# EAGLE design 8x8BulbMatrix (EAGLE 9.6.2)
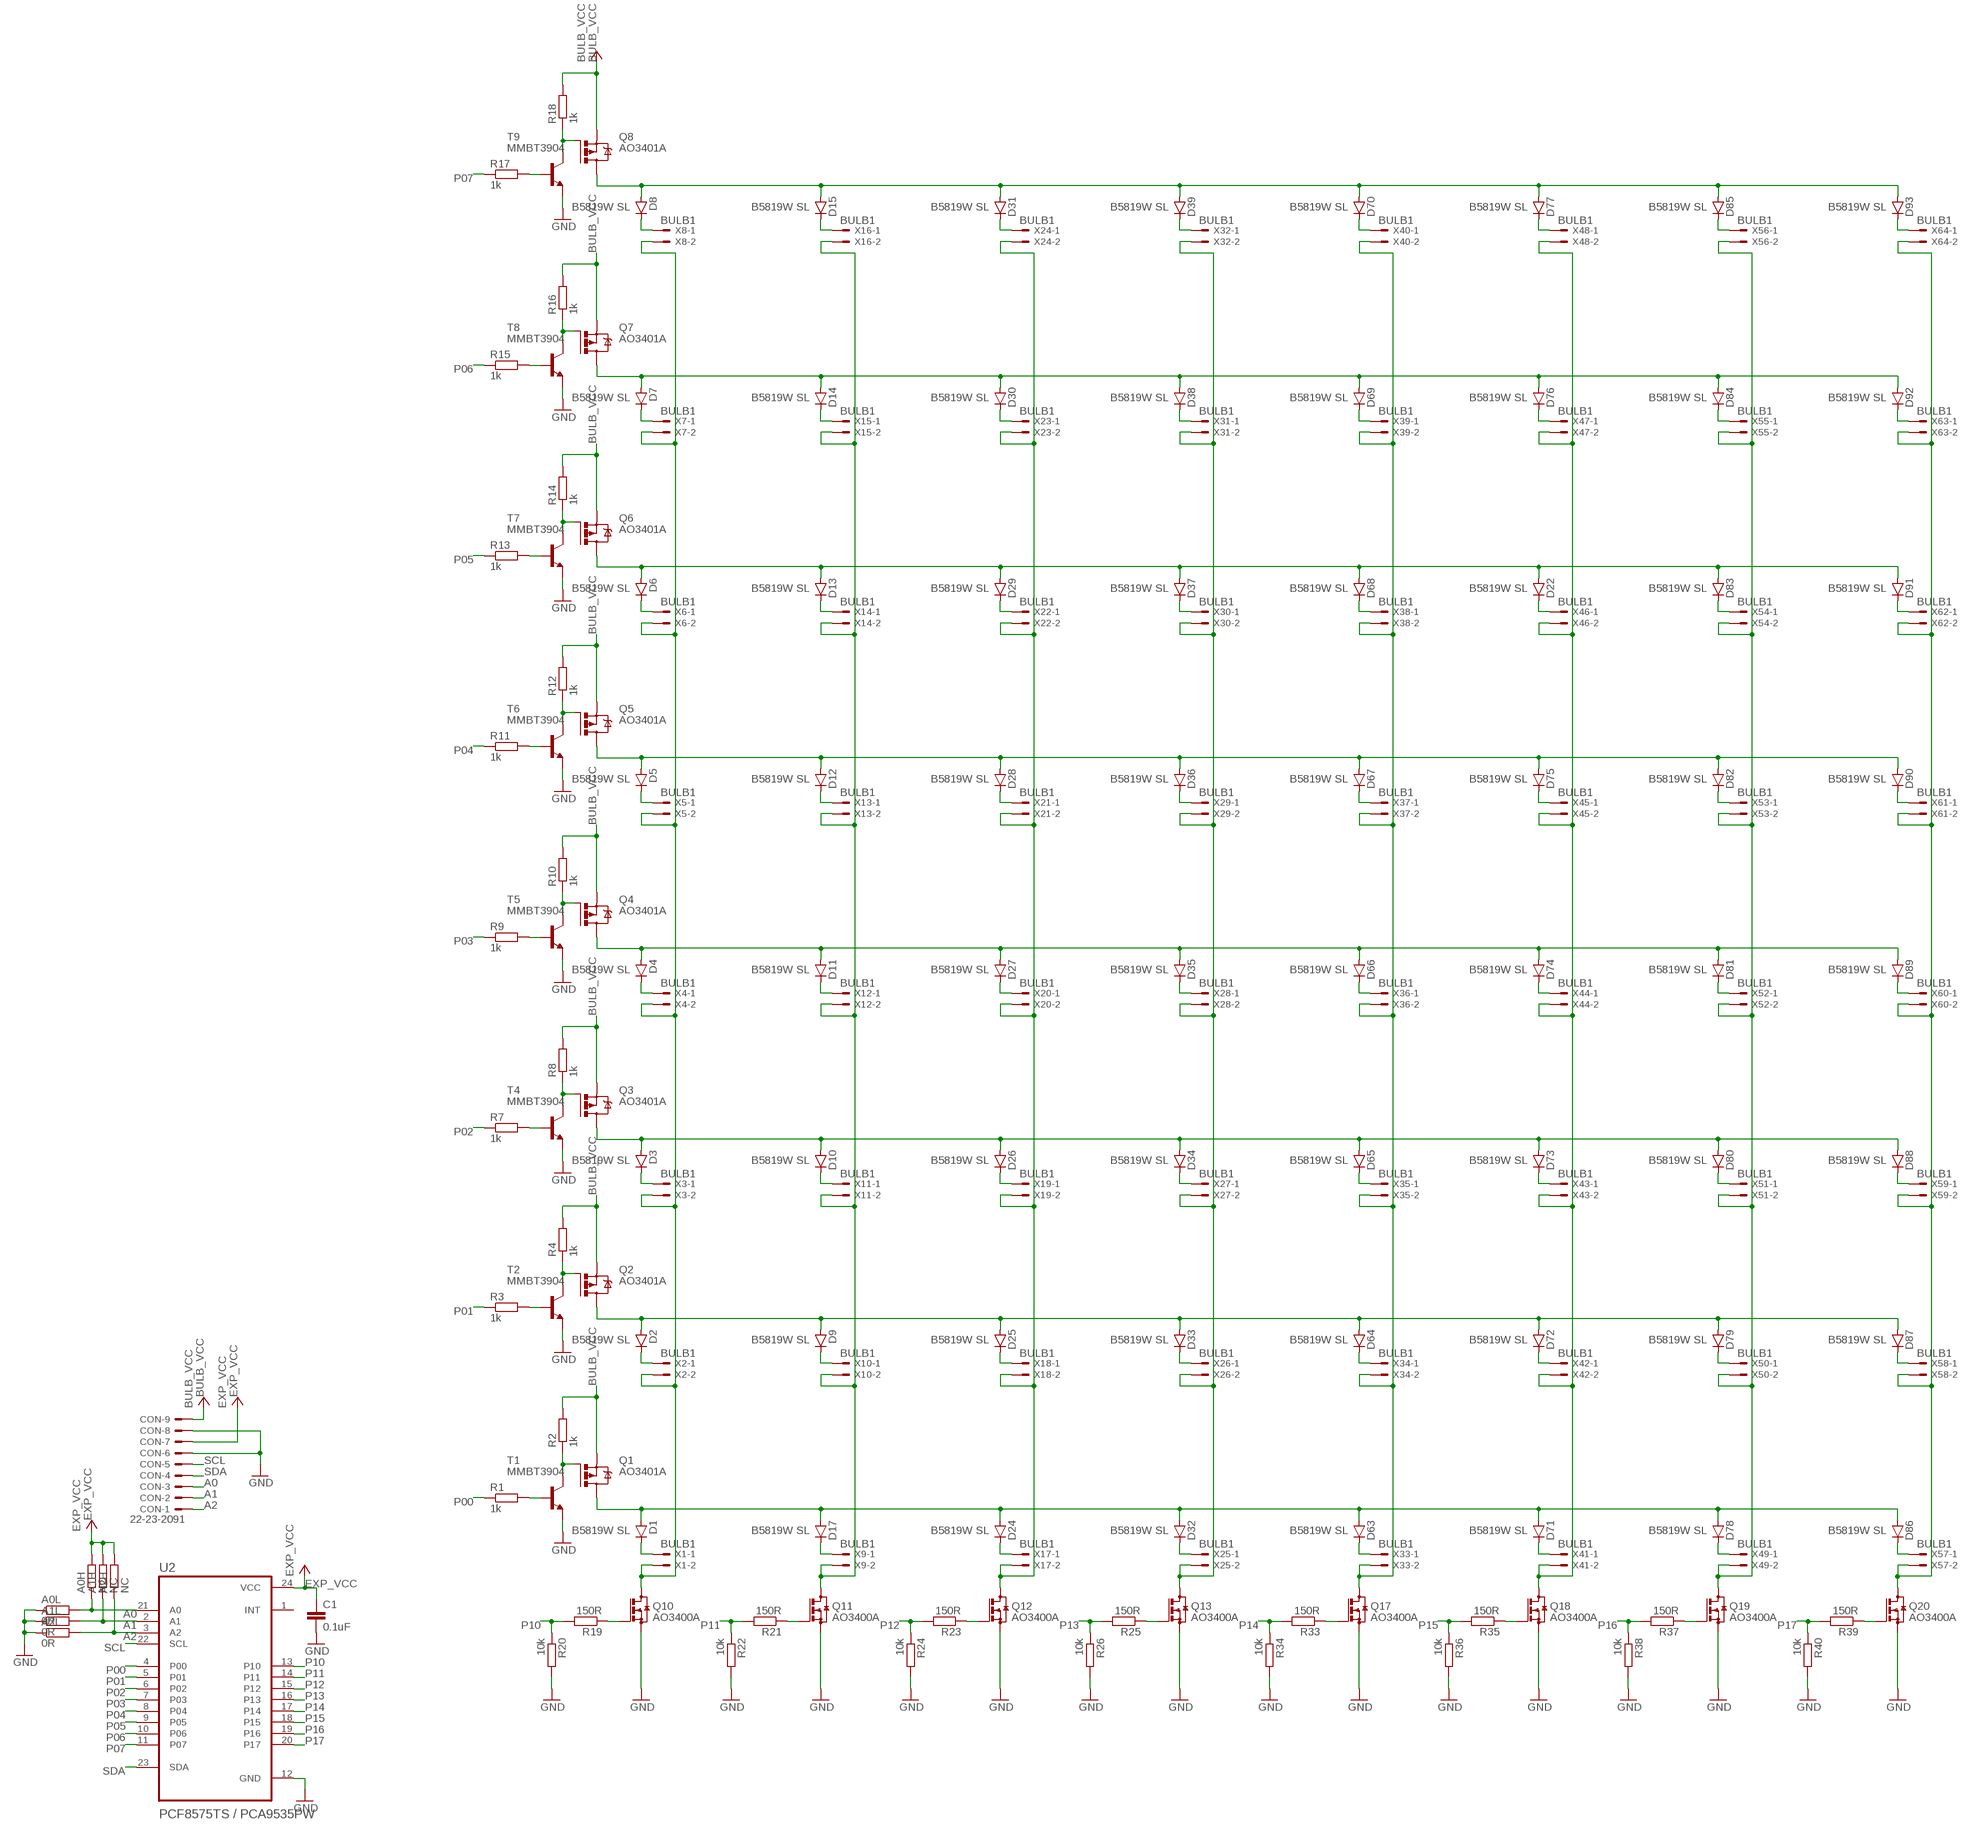
[diagram p0: schematic, sheet 1]

## Parts
A0H  NC  R-EU_R0603  [R0603]
A0L  0R  R-EU_R0603  [R0603]
A1H  NC  R-EU_R0603  [R0603]
A1L  0R  R-EU_R0603  [R0603]
A2H  NC  R-EU_R0603  [R0603]
A2L  0R  R-EU_R0603  [R0603]
C1  0.1uF  C-EUC0805  [C0805]
CON  22-23-2091  [22-23-2091]
D1  B5819W SL  D-SOD123  [SOD123]
D2  B5819W SL  D-SOD123  [SOD123]
D3  B5819W SL  D-SOD123  [SOD123]
D4  B5819W SL  D-SOD123  [SOD123]
D5  B5819W SL  D-SOD123  [SOD123]
D6  B5819W SL  D-SOD123  [SOD123]
D7  B5819W SL  D-SOD123  [SOD123]
D8  B5819W SL  D-SOD123  [SOD123]
D9  B5819W SL  D-SOD123  [SOD123]
D10  B5819W SL  D-SOD123  [SOD123]
D11  B5819W SL  D-SOD123  [SOD123]
D12  B5819W SL  D-SOD123  [SOD123]
D13  B5819W SL  D-SOD123  [SOD123]
D14  B5819W SL  D-SOD123  [SOD123]
D15  B5819W SL  D-SOD123  [SOD123]
D17  B5819W SL  D-SOD123  [SOD123]
D22  B5819W SL  D-SOD123  [SOD123]
D24  B5819W SL  D-SOD123  [SOD123]
D25  B5819W SL  D-SOD123  [SOD123]
D26  B5819W SL  D-SOD123  [SOD123]
D27  B5819W SL  D-SOD123  [SOD123]
D28  B5819W SL  D-SOD123  [SOD123]
D29  B5819W SL  D-SOD123  [SOD123]
D30  B5819W SL  D-SOD123  [SOD123]
D31  B5819W SL  D-SOD123  [SOD123]
D32  B5819W SL  D-SOD123  [SOD123]
D33  B5819W SL  D-SOD123  [SOD123]
D34  B5819W SL  D-SOD123  [SOD123]
D35  B5819W SL  D-SOD123  [SOD123]
D36  B5819W SL  D-SOD123  [SOD123]
D37  B5819W SL  D-SOD123  [SOD123]
D38  B5819W SL  D-SOD123  [SOD123]
D39  B5819W SL  D-SOD123  [SOD123]
D63  B5819W SL  D-SOD123  [SOD123]
D64  B5819W SL  D-SOD123  [SOD123]
D65  B5819W SL  D-SOD123  [SOD123]
D66  B5819W SL  D-SOD123  [SOD123]
D67  B5819W SL  D-SOD123  [SOD123]
D68  B5819W SL  D-SOD123  [SOD123]
D69  B5819W SL  D-SOD123  [SOD123]
D70  B5819W SL  D-SOD123  [SOD123]
D71  B5819W SL  D-SOD123  [SOD123]
D72  B5819W SL  D-SOD123  [SOD123]
D73  B5819W SL  D-SOD123  [SOD123]
D74  B5819W SL  D-SOD123  [SOD123]
D75  B5819W SL  D-SOD123  [SOD123]
D76  B5819W SL  D-SOD123  [SOD123]
D77  B5819W SL  D-SOD123  [SOD123]
D78  B5819W SL  D-SOD123  [SOD123]
D79  B5819W SL  D-SOD123  [SOD123]
D80  B5819W SL  D-SOD123  [SOD123]
D81  B5819W SL  D-SOD123  [SOD123]
D82  B5819W SL  D-SOD123  [SOD123]
D83  B5819W SL  D-SOD123  [SOD123]
D84  B5819W SL  D-SOD123  [SOD123]
D85  B5819W SL  D-SOD123  [SOD123]
D86  B5819W SL  D-SOD123  [SOD123]
D87  B5819W SL  D-SOD123  [SOD123]
D88  B5819W SL  D-SOD123  [SOD123]
D89  B5819W SL  D-SOD123  [SOD123]
D90  B5819W SL  D-SOD123  [SOD123]
D91  B5819W SL  D-SOD123  [SOD123]
D92  B5819W SL  D-SOD123  [SOD123]
D93  B5819W SL  D-SOD123  [SOD123]
Q1  AO3401A  IRLML5203  [MICRO3]
Q2  AO3401A  IRLML5203  [MICRO3]
Q3  AO3401A  IRLML5203  [MICRO3]
Q4  AO3401A  IRLML5203  [MICRO3]
Q5  AO3401A  IRLML5203  [MICRO3]
Q6  AO3401A  IRLML5203  [MICRO3]
Q7  AO3401A  IRLML5203  [MICRO3]
Q8  AO3401A  IRLML5203  [MICRO3]
Q10  AO3400A  BSS123  [SOT23]
Q11  AO3400A  BSS123  [SOT23]
Q12  AO3400A  BSS123  [SOT23]
Q13  AO3400A  BSS123  [SOT23]
Q17  AO3400A  BSS123  [SOT23]
Q18  AO3400A  BSS123  [SOT23]
Q19  AO3400A  BSS123  [SOT23]
Q20  AO3400A  BSS123  [SOT23]
R1  1k  R-EU_R0603  [R0603]
R2  1k  R-EU_R0603  [R0603]
R3  1k  R-EU_R0603  [R0603]
R4  1k  R-EU_R0603  [R0603]
R7  1k  R-EU_R0603  [R0603]
R8  1k  R-EU_R0603  [R0603]
R9  1k  R-EU_R0603  [R0603]
R10  1k  R-EU_R0603  [R0603]
R11  1k  R-EU_R0603  [R0603]
R12  1k  R-EU_R0603  [R0603]
R13  1k  R-EU_R0603  [R0603]
R14  1k  R-EU_R0603  [R0603]
R15  1k  R-EU_R0603  [R0603]
R16  1k  R-EU_R0603  [R0603]
R17  1k  R-EU_R0603  [R0603]
R18  1k  R-EU_R0603  [R0603]
R19  150R  R-EU_R0603  [R0603]
R20  10k  R-EU_R0603  [R0603]
R21  150R  R-EU_R0603  [R0603]
R22  10k  R-EU_R0603  [R0603]
R23  150R  R-EU_R0603  [R0603]
R24  10k  R-EU_R0603  [R0603]
R25  150R  R-EU_R0603  [R0603]
R26  10k  R-EU_R0603  [R0603]
R33  150R  R-EU_R0603  [R0603]
R34  10k  R-EU_R0603  [R0603]
R35  150R  R-EU_R0603  [R0603]
R36  10k  R-EU_R0603  [R0603]
R37  150R  R-EU_R0603  [R0603]
R38  10k  R-EU_R0603  [R0603]
R39  150R  R-EU_R0603  [R0603]
R40  10k  R-EU_R0603  [R0603]
T1  MMBT3904  BC847  [SOT23]
T2  MMBT3904  BC847  [SOT23]
T4  MMBT3904  BC847  [SOT23]
T5  MMBT3904  BC847  [SOT23]
T6  MMBT3904  BC847  [SOT23]
T7  MMBT3904  BC847  [SOT23]
T8  MMBT3904  BC847  [SOT23]
T9  MMBT3904  BC847  [SOT23]
U2  PCF8575TS / PCA9535PW  PCF8575DB  [SOP65P780X200-24N]
X1  BULB1  22-23-2021  [22-23-2021]
X2  BULB1  22-23-2021  [22-23-2021]
X3  BULB1  22-23-2021  [22-23-2021]
X4  BULB1  22-23-2021  [22-23-2021]
X5  BULB1  22-23-2021  [22-23-2021]
X6  BULB1  22-23-2021  [22-23-2021]
X7  BULB1  22-23-2021  [22-23-2021]
X8  BULB1  22-23-2021  [22-23-2021]
X9  BULB1  22-23-2021  [22-23-2021]
X10  BULB1  22-23-2021  [22-23-2021]
X11  BULB1  22-23-2021  [22-23-2021]
X12  BULB1  22-23-2021  [22-23-2021]
X13  BULB1  22-23-2021  [22-23-2021]
X14  BULB1  22-23-2021  [22-23-2021]
X15  BULB1  22-23-2021  [22-23-2021]
X16  BULB1  22-23-2021  [22-23-2021]
X17  BULB1  22-23-2021  [22-23-2021]
X18  BULB1  22-23-2021  [22-23-2021]
X19  BULB1  22-23-2021  [22-23-2021]
X20  BULB1  22-23-2021  [22-23-2021]
X21  BULB1  22-23-2021  [22-23-2021]
X22  BULB1  22-23-2021  [22-23-2021]
X23  BULB1  22-23-2021  [22-23-2021]
X24  BULB1  22-23-2021  [22-23-2021]
X25  BULB1  22-23-2021  [22-23-2021]
X26  BULB1  22-23-2021  [22-23-2021]
X27  BULB1  22-23-2021  [22-23-2021]
X28  BULB1  22-23-2021  [22-23-2021]
X29  BULB1  22-23-2021  [22-23-2021]
X30  BULB1  22-23-2021  [22-23-2021]
X31  BULB1  22-23-2021  [22-23-2021]
X32  BULB1  22-23-2021  [22-23-2021]
X33  BULB1  22-23-2021  [22-23-2021]
X34  BULB1  22-23-2021  [22-23-2021]
X35  BULB1  22-23-2021  [22-23-2021]
X36  BULB1  22-23-2021  [22-23-2021]
X37  BULB1  22-23-2021  [22-23-2021]
X38  BULB1  22-23-2021  [22-23-2021]
X39  BULB1  22-23-2021  [22-23-2021]
X40  BULB1  22-23-2021  [22-23-2021]
X41  BULB1  22-23-2021  [22-23-2021]
X42  BULB1  22-23-2021  [22-23-2021]
X43  BULB1  22-23-2021  [22-23-2021]
X44  BULB1  22-23-2021  [22-23-2021]
X45  BULB1  22-23-2021  [22-23-2021]
X46  BULB1  22-23-2021  [22-23-2021]
X47  BULB1  22-23-2021  [22-23-2021]
X48  BULB1  22-23-2021  [22-23-2021]
X49  BULB1  22-23-2021  [22-23-2021]
X50  BULB1  22-23-2021  [22-23-2021]
X51  BULB1  22-23-2021  [22-23-2021]
X52  BULB1  22-23-2021  [22-23-2021]
X53  BULB1  22-23-2021  [22-23-2021]
X54  BULB1  22-23-2021  [22-23-2021]
X55  BULB1  22-23-2021  [22-23-2021]
X56  BULB1  22-23-2021  [22-23-2021]
X57  BULB1  22-23-2021  [22-23-2021]
X58  BULB1  22-23-2021  [22-23-2021]
X59  BULB1  22-23-2021  [22-23-2021]
X60  BULB1  22-23-2021  [22-23-2021]
X61  BULB1  22-23-2021  [22-23-2021]
X62  BULB1  22-23-2021  [22-23-2021]
X63  BULB1  22-23-2021  [22-23-2021]
X64  BULB1  22-23-2021  [22-23-2021]

## Nets
A0: A0H.1 A0L.2 CON.3 U2.21(A0)
A1: A1H.1 A1L.2 CON.2 U2.2(A1)
A2: A2H.1 A2L.2 CON.1 U2.3(A2)
BULB_VCC: CON.9 Q1.2(S) Q2.2(S) Q3.2(S) Q4.2(S) Q5.2(S) Q6.2(S) Q7.2(S) Q8.2(S) R2.2 R4.2 R8.2 R10.2 R12.2 R14.2 R16.2 R18.2
EXP_VCC: A0H.2 A1H.2 A2H.2 C1.1 CON.7 U2.24(VCC)
GND: A0L.1 A1L.1 A2L.1 C1.2 CON.6 CON.8 Q10.2(S) Q11.2(S) Q12.2(S) Q13.2(S) Q17.2(S) Q18.2(S) Q19.2(S) Q20.2(S) R20.2 R22.2 R24.2 R26.2 R34.2 R36.2 R38.2 R40.2 T1.2(E) T2.2(E) T4.2(E) T5.2(E) T6.2(E) T7.2(E) T8.2(E) T9.2(E) U2.12(GND)
N$1: Q10.3(D) X1.2 X2.2 X3.2 X4.2 X5.2 X6.2 X7.2 X8.2
N$3: D1.1(C) X1.1
N$4: R1.2 T1.1(B)
N$5: Q1.1(G) R2.1 T1.3(C)
N$6: Q11.1(G) R21.1
N$7: R3.2 T2.1(B)
N$8: Q2.1(G) R4.1 T2.3(C)
N$9: Q12.1(G) R23.1
N$10: D2.1(C) X2.1
N$11: D3.1(C) X3.1
N$12: Q13.1(G) R25.1
N$14: D4.1(C) X4.1
N$17: D5.1(C) X5.1
N$19: R7.2 T4.1(B)
N$20: D6.1(C) X6.1
N$22: Q3.1(G) R8.1 T4.3(C)
N$23: D7.1(C) X7.1
N$24: Q10.1(G) R19.1
N$25: R9.2 T5.1(B)
N$26: D8.1(C) X8.1
N$28: Q4.1(G) R10.1 T5.3(C)
N$29: R11.2 T6.1(B)
N$30: Q5.1(G) R12.1 T6.3(C)
N$31: R13.2 T7.1(B)
N$32: Q6.1(G) R14.1 T7.3(C)
N$33: R15.2 T8.1(B)
N$34: Q7.1(G) R16.1 T8.3(C)
N$35: R17.2 T9.1(B)
N$36: Q8.1(G) R18.1 T9.3(C)
N$45: D24.1(C) X17.1
N$46: Q12.3(D) X17.2 X18.2 X19.2 X20.2 X21.2 X22.2 X23.2 X24.2
N$48: D25.1(C) X18.1
N$50: D26.1(C) X19.1
N$51: D27.1(C) X20.1
N$52: D17.1(C) X9.1
N$53: Q11.3(D) X9.2 X10.2 X11.2 X12.2 X13.2 X14.2 X15.2 X16.2
N$55: D9.1(C) X10.1
N$56: D32.1(C) X25.1
N$57: D10.1(C) X11.1
N$58: D11.1(C) X12.1
N$59: D12.1(C) X13.1
N$60: D13.1(C) X14.1
N$61: D14.1(C) X15.1
N$62: D15.1(C) X16.1
N$63: Q13.3(D) X25.2 X26.2 X27.2 X28.2 X29.2 X30.2 X31.2 X32.2
N$65: D33.1(C) X26.1
N$67: D34.1(C) X27.1
N$68: D35.1(C) X28.1
N$69: D28.1(C) X21.1
N$70: D29.1(C) X22.1
N$71: D30.1(C) X23.1
N$72: D31.1(C) X24.1
N$79: D36.1(C) X29.1
N$80: D37.1(C) X30.1
N$81: D38.1(C) X31.1
N$82: D39.1(C) X32.1
N$113: D63.1(C) X33.1
N$114: Q17.3(D) X33.2 X34.2 X35.2 X36.2 X37.2 X38.2 X39.2 X40.2
N$115: D64.1(C) X34.1
N$116: D65.1(C) X35.1
N$117: D66.1(C) X36.1
N$118: D67.1(C) X37.1
N$119: D68.1(C) X38.1
N$120: D69.1(C) X39.1
N$121: D70.1(C) X40.1
N$122: Q17.1(G) R33.1
N$123: D71.1(C) X41.1
N$124: Q18.3(D) X41.2 X42.2 X43.2 X44.2 X45.2 X46.2 X47.2 X48.2
N$125: D72.1(C) X42.1
N$126: D73.1(C) X43.1
N$127: D74.1(C) X44.1
N$128: D75.1(C) X45.1
N$129: D22.1(C) X46.1
N$130: D76.1(C) X47.1
N$131: D77.1(C) X48.1
N$132: Q18.1(G) R35.1
N$133: D78.1(C) X49.1
N$134: Q19.3(D) X49.2 X50.2 X51.2 X52.2 X53.2 X54.2 X55.2 X56.2
N$135: D79.1(C) X50.1
N$136: D80.1(C) X51.1
N$137: D81.1(C) X52.1
N$138: D82.1(C) X53.1
N$139: D83.1(C) X54.1
N$140: D84.1(C) X55.1
N$141: D85.1(C) X56.1
N$142: Q19.1(G) R37.1
N$143: D86.1(C) X57.1
N$144: Q20.3(D) X57.2 X58.2 X59.2 X60.2 X61.2 X62.2 X63.2 X64.2
N$145: D1.2(A) D17.2(A) D24.2(A) D32.2(A) D63.2(A) D71.2(A) D78.2(A) D86.2(A) Q1.3(D)
N$146: D87.1(C) X58.1
N$147: D2.2(A) D9.2(A) D25.2(A) D33.2(A) D64.2(A) D72.2(A) D79.2(A) D87.2(A) Q2.3(D)
N$148: D88.1(C) X59.1
N$149: D89.1(C) X60.1
N$150: D90.1(C) X61.1
N$151: D91.1(C) X62.1
N$152: D92.1(C) X63.1
N$153: D93.1(C) X64.1
N$154: D3.2(A) D10.2(A) D26.2(A) D34.2(A) D65.2(A) D73.2(A) D80.2(A) D88.2(A) Q3.3(D)
N$155: D4.2(A) D11.2(A) D27.2(A) D35.2(A) D66.2(A) D74.2(A) D81.2(A) D89.2(A) Q4.3(D)
N$156: D5.2(A) D12.2(A) D28.2(A) D36.2(A) D67.2(A) D75.2(A) D82.2(A) D90.2(A) Q5.3(D)
N$157: D6.2(A) D13.2(A) D22.2(A) D29.2(A) D37.2(A) D68.2(A) D83.2(A) D91.2(A) Q6.3(D)
N$158: D7.2(A) D14.2(A) D30.2(A) D38.2(A) D69.2(A) D76.2(A) D84.2(A) D92.2(A) Q7.3(D)
N$159: D8.2(A) D15.2(A) D31.2(A) D39.2(A) D70.2(A) D77.2(A) D85.2(A) D93.2(A) Q8.3(D)
N$160: Q20.1(G) R39.1
P00: R1.1 U2.4(P00)
P01: R3.1 U2.5(P01)
P02: R7.1 U2.6(P02)
P03: R9.1 U2.7(P03)
P04: R11.1 U2.8(P04)
P05: R13.1 U2.9(P05)
P06: R15.1 U2.10(P06)
P07: R17.1 U2.11(P07)
P10: R19.2 R20.1 U2.13(P10)
P11: R21.2 R22.1 U2.14(P11)
P12: R23.2 R24.1 U2.15(P12)
P13: R25.2 R26.1 U2.16(P13)
P14: R33.2 R34.1 U2.17(P14)
P15: R35.2 R36.1 U2.18(P15)
P16: R37.2 R38.1 U2.19(P16)
P17: R39.2 R40.1 U2.20(P17)
SCL: CON.5 U2.22(SCL)
SDA: CON.4 U2.23(SDA)
Unconnected: U2.1(INT)

## Library data of the parts
A0H A0L A1H A1L A2H A2L R1-R4 R7-R26 R33-R40 = rcl:R-EU_: RESISTOR, European symbol; SPICEPREFIX: R
C1 = rcl:C-EU: CAPACITOR, European symbol; SPICEPREFIX: C
CON = con-molex:22-23-2091: .100" (2.54mm) Center Header - 9 Pin; MF: MOLEX; MPN: 22-23-2091; OC_FARNELL: 1756827; OC_NEWARK: 56H0450
D1-D15 D17 D22 D24-D39 D63-D93 = semicon-smd-ipc:D-: DIODE unfilled
Q1-Q8 = transistor-power:IRLML5203: HEXFET P-Channel Power MOSFET
Q10-Q13 Q17-Q20 = transistor-small-signal:BSS123: N-CHANNEL MOS FET
T1 T2 T4-T9 = transistor:BC847: NPN TRANSISTOR
U2 = PCF8575DB:PCF8575DB: None Check prices <https://pricing.snapeda.com/parts/PCF8575DB/Texas%20Instruments/view-part?ref=eda>; AVAILABILITY: In Stock; DESCRIPTION: Remote 16-Bit I2C and SMBus I/O Expander with Interrupt Output 24-SSOP -40 to 85; MF: Texas Instruments; MP: PCF8575DB; PACKAGE: SSOP-24 Texas Instruments; PRICE: None; PURCHASE-URL: https://pricing.snapeda.com/search/part/PCF8575DB/?ref=eda
X1-X64 = con-molex:22-23-2021: .100" (2.54mm) Center Header - 2 Pin; MF: MOLEX; MPN: 22-23-2021; OC_FARNELL: 1462926; OC_NEWARK: 25C3832

## Board
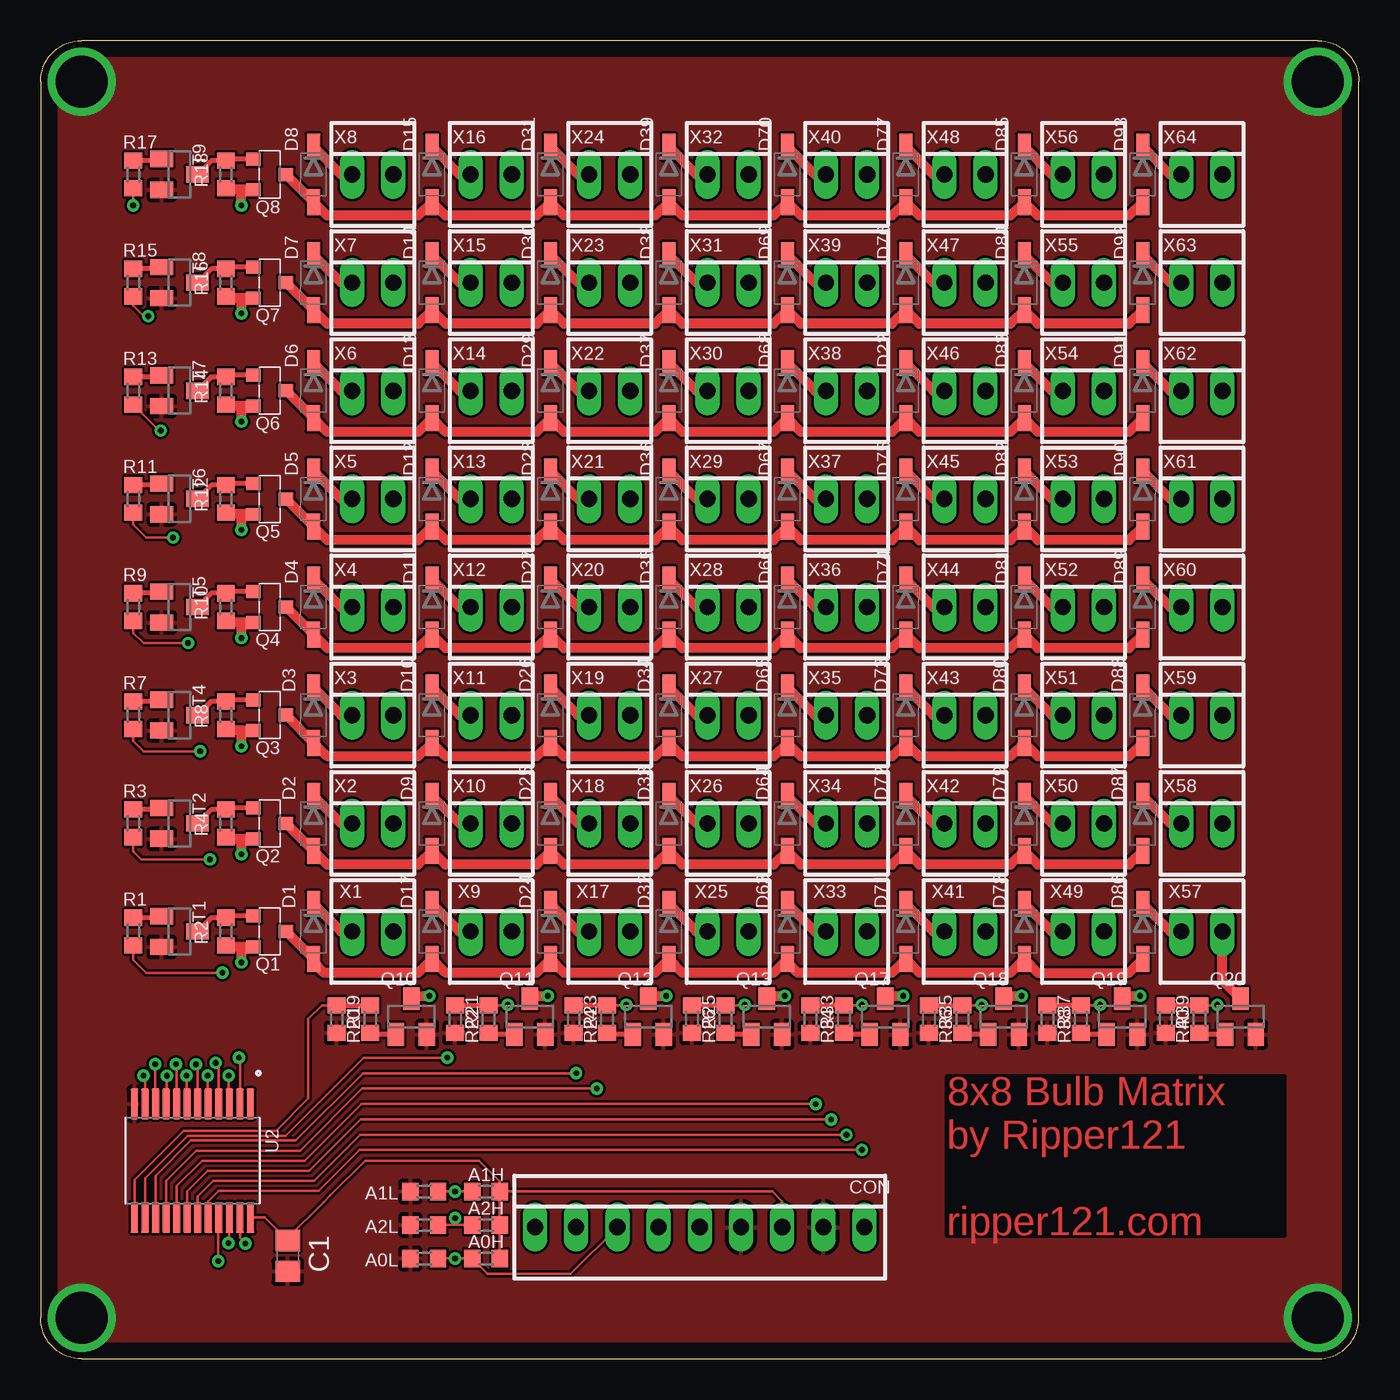
[diagram p1: board, top side]
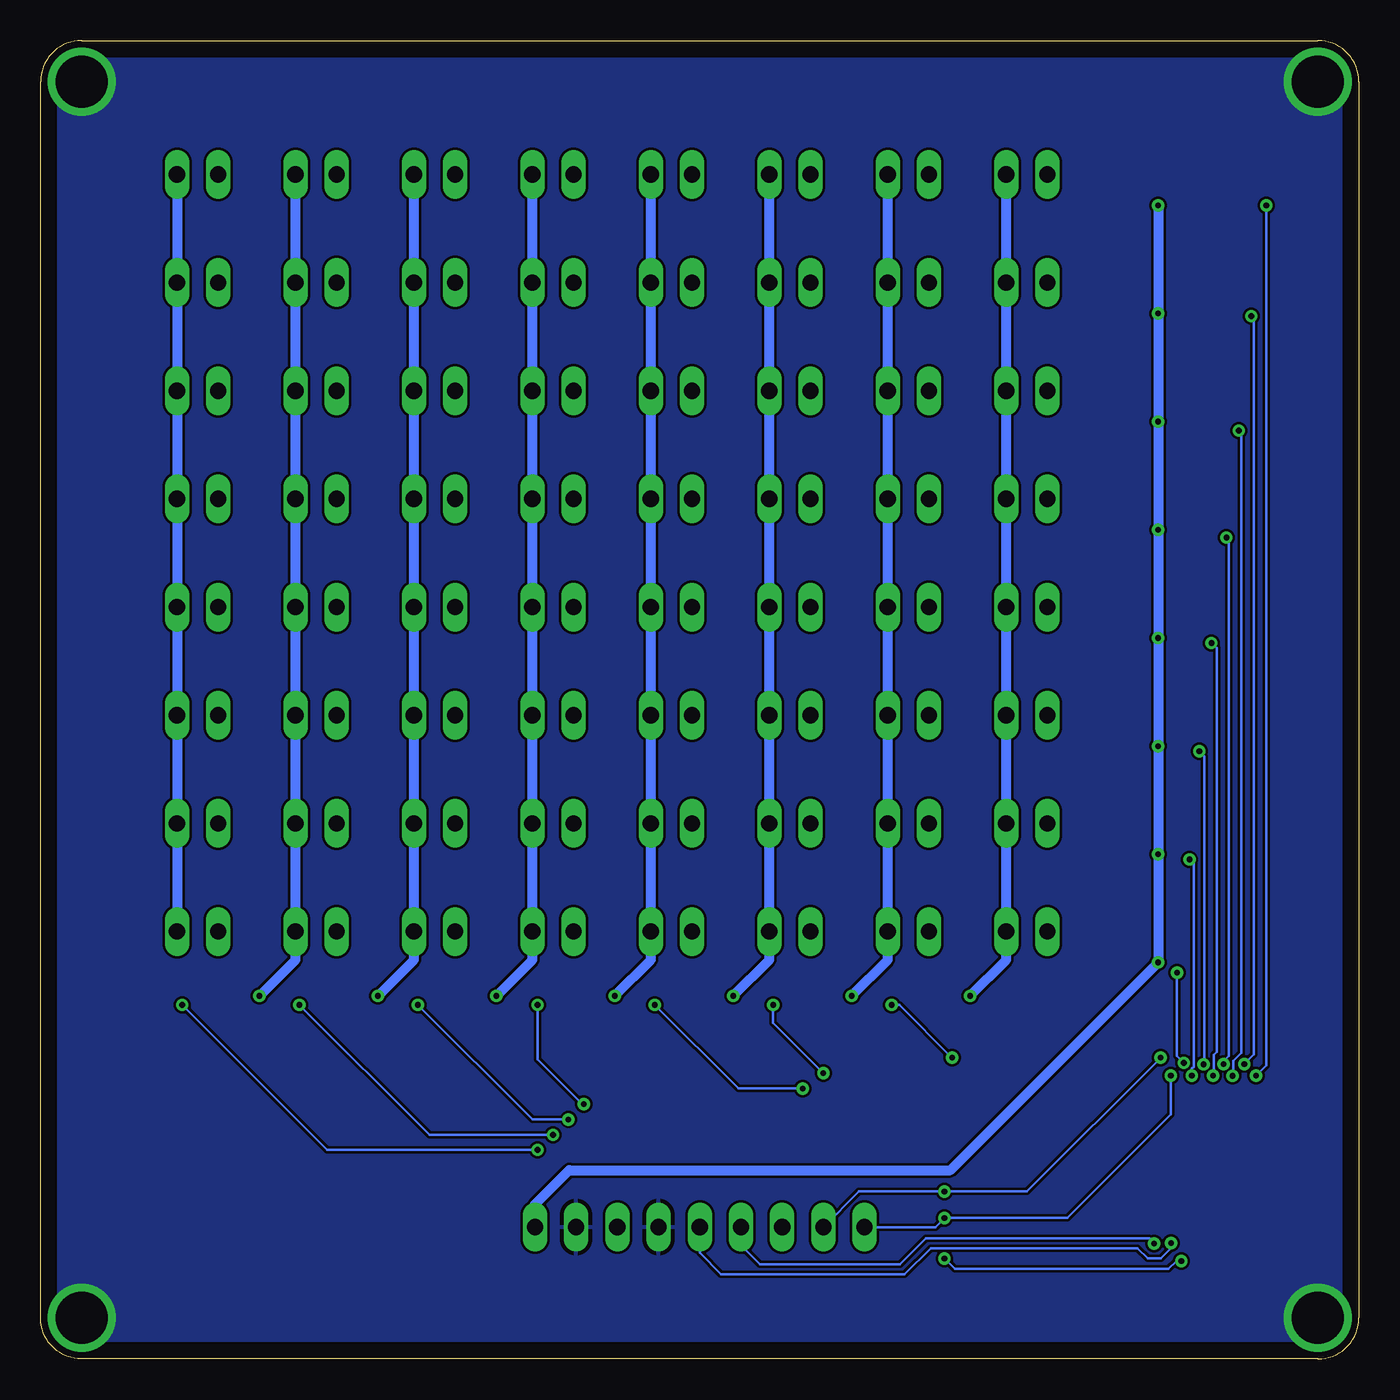
[diagram p2: board, bottom side, seen from below]

Size 81.28 x 81.28 mm. Coordinates in mm from the lower left corner, seen from the top.
Outline: 2.54,0 78.74,0 arc90 81.28,2.54 81.28,78.74 arc90 78.74,81.28 2.54,81.28 arc90 0,78.74 0,2.54 arc90 2.54,0
Copper layers (1*16): Top 0.035mm / dielectric 1.5mm / Bottom 0.035mm
Design rules "default": minimum track width 6mil, minimum drill 0.35mm, track to track 6mil, track to pad 6mil, pad to pad 6mil, via to via 6mil, smd to smd 6mil, copper to edge 40mil, drill to drill 6mil, minimum pad ring 10mil, minimum via ring 8mil, stop-mask expansion 4mil, vias tented up to drill 0mil, thermal gap 10mil

### Footprints (pad centres in the part's own frame; a part is rotated, then mirrored left to right if it is on the bottom)
R0603 = smd 1 x 1.1: 1 -0.85,0; 2 0.85,0
C0805 = smd 1.3 x 1.5: 1 -0.95,0; 2 0.95,0
22-23-2091 = drill 1 long: 1 -10.16,0; 2 -7.62,0; 3 -5.08,0; 4 -2.54,0; 5 0,0; 6 2.54,0; 7 5.08,0; 8 7.62,0; 9 10.16,0
SOD123 = smd 1.6 x 0.8: 1 -1.7,0; 2 1.7,0
MICRO3 = smd 0.8 x 0.9: 1 -0.95,-1; 2 0.95,-1; 3 0,1
SOT23 = smd 1 x 1.4: 1 -0.95,-1.1; 2 0.95,-1.1; 3 0,1.1
SOP65P780X200-24N = smd 1.9 x 0.48: 1 -3.505,3.575; 2 -3.505,2.925; 3 -3.505,2.275; 4 -3.505,1.625; 5 -3.505,0.975; 6 -3.505,0.325; 7 -3.505,-0.325; 8 -3.505,-0.975; 9 -3.505,-1.625; 10 -3.505,-2.275; 11 -3.505,-2.925; 12 -3.505,-3.575; 13 3.505,-3.575; 14 3.505,-2.925; 15 3.505,-2.275; 16 3.505,-1.625; 17 3.505,-0.975; 18 3.505,-0.325; 19 3.505,0.325; 20 3.505,0.975; 21 3.505,1.625; 22 3.505,2.275; 23 3.505,2.925; 24 3.505,3.575
22-23-2021 = drill 1 long: 1 -1.27,0; 2 1.27,0

### Placement (x,y rotation side)
A0H  27.46,6.19 0 top
A0L  23.65,6.19 0 top
A1H  27.46,10.32 0 top
A1L  23.65,10.32 0 top
A2H  27.46,8.26 0 top
A2L  23.65,8.26 0 top
C1  15.24,6.35 270 top
CON  40.64,8.13 0 top
D1  16.83,26.35 270 top
D2  16.83,33.02 270 top
D3  16.83,39.69 270 top
D4  16.83,46.35 270 top
D5  16.83,53.02 270 top
D6  16.83,59.69 270 top
D7  16.83,66.36 270 top
D8  16.83,73.03 270 top
D9  24.13,33.02 270 top
D10  24.13,39.69 270 top
D11  24.13,46.35 270 top
D12  24.13,53.02 270 top
D13  24.13,59.69 270 top
D14  24.13,66.36 270 top
D15  24.13,73.03 270 top
D17  24.13,26.35 270 top
D22  53.34,59.69 270 top
D24  31.43,26.35 270 top
D25  31.43,33.02 270 top
D26  31.43,39.69 270 top
D27  31.43,46.35 270 top
D28  31.43,53.02 270 top
D29  31.43,59.69 270 top
D30  31.43,66.36 270 top
D31  31.43,73.03 270 top
D32  38.73,26.35 270 top
D33  38.73,33.02 270 top
D34  38.73,39.69 270 top
D35  38.73,46.35 270 top
D36  38.73,53.02 270 top
D37  38.73,59.69 270 top
D38  38.73,66.36 270 top
D39  38.73,73.03 270 top
D63  46.04,26.35 270 top
D64  46.04,33.02 270 top
D65  46.04,39.69 270 top
D66  46.04,46.35 270 top
D67  46.04,53.02 270 top
D68  46.04,59.69 270 top
D69  46.04,66.36 270 top
D70  46.04,73.03 270 top
D71  53.34,26.35 270 top
D72  53.34,33.02 270 top
D73  53.34,39.69 270 top
D74  53.34,46.35 270 top
D75  53.34,53.02 270 top
D76  53.34,66.36 270 top
D77  53.34,73.03 270 top
D78  60.64,26.35 270 top
D79  60.64,33.02 270 top
D80  60.64,39.69 270 top
D81  60.64,46.35 270 top
D82  60.64,53.02 270 top
D83  60.64,59.69 270 top
D84  60.64,66.36 270 top
D85  60.64,73.03 270 top
D86  67.94,26.35 270 top
D87  67.94,33.02 270 top
D88  67.94,39.69 270 top
D89  67.94,46.35 270 top
D90  67.94,53.02 270 top
D91  67.94,59.69 270 top
D92  67.94,66.36 270 top
D93  67.94,73.03 270 top
Q1  14.13,26.35 270 top
Q2  14.13,33.02 270 top
Q3  14.13,39.69 270 top
Q4  14.13,46.35 270 top
Q5  14.13,53.02 270 top
Q6  14.13,59.69 270 top
Q7  14.13,66.36 270 top
Q8  14.13,73.03 270 top
Q10  22.86,21.11 0 top
Q11  30.16,21.11 0 top
Q12  37.47,21.11 0 top
Q13  44.77,21.11 0 top
Q17  52.07,21.11 0 top
Q18  59.37,21.11 0 top
Q19  66.67,21.11 0 top
Q20  73.98,21.11 0 top
R1  5.71,26.35 90 top
R2  11.43,26.35 270 top
R3  5.71,33.02 90 top
R4  11.43,33.02 270 top
R7  5.71,39.69 90 top
R8  11.43,39.69 270 top
R9  5.71,46.35 90 top
R10  11.43,46.35 270 top
R11  5.71,53.02 90 top
R12  11.43,53.02 270 top
R13  5.71,59.69 90 top
R14  11.43,59.69 270 top
R15  5.71,66.36 90 top
R16  11.43,66.36 270 top
R17  5.71,73.03 90 top
R18  11.43,73.03 270 top
R19  20.32,20.95 90 top
R20  18.26,20.95 270 top
R21  27.62,20.95 90 top
R22  25.56,20.95 270 top
R23  34.92,20.95 90 top
R24  32.86,20.95 270 top
R25  42.23,20.95 90 top
R26  40.16,20.95 270 top
R33  49.53,20.95 90 top
R34  47.47,20.95 270 top
R35  56.83,20.95 90 top
R36  54.77,20.95 270 top
R37  64.14,20.95 90 top
R38  62.07,20.95 270 top
R39  71.44,20.95 90 top
R40  69.37,20.95 270 top
T1  8.57,26.35 270 top
T2  8.57,33.02 270 top
T4  8.57,39.69 270 top
T5  8.57,46.35 270 top
T6  8.57,53.02 270 top
T7  8.57,59.69 270 top
T8  8.57,66.36 270 top
T9  8.57,73.03 270 top
U2  9.37,12.22 270 top
X1  20.48,26.35 0 top
X2  20.48,33.02 0 top
X3  20.48,39.69 0 top
X4  20.48,46.35 0 top
X5  20.48,53.02 0 top
X6  20.48,59.69 0 top
X7  20.48,66.36 0 top
X8  20.48,73.03 0 top
X9  27.78,26.35 0 top
X10  27.78,33.02 0 top
X11  27.78,39.69 0 top
X12  27.78,46.35 0 top
X13  27.78,53.02 0 top
X14  27.78,59.69 0 top
X15  27.78,66.36 0 top
X16  27.78,73.03 0 top
X17  35.08,26.35 0 top
X18  35.08,33.02 0 top
X19  35.08,39.69 0 top
X20  35.08,46.35 0 top
X21  35.08,53.02 0 top
X22  35.08,59.69 0 top
X23  35.08,66.36 0 top
X24  35.08,73.03 0 top
X25  42.39,26.35 0 top
X26  42.39,33.02 0 top
X27  42.39,39.69 0 top
X28  42.39,46.35 0 top
X29  42.39,53.02 0 top
X30  42.39,59.69 0 top
X31  42.39,66.36 0 top
X32  42.39,73.03 0 top
X33  49.69,26.35 0 top
X34  49.69,33.02 0 top
X35  49.69,39.69 0 top
X36  49.69,46.35 0 top
X37  49.69,53.02 0 top
X38  49.69,59.69 0 top
X39  49.69,66.36 0 top
X40  49.69,73.03 0 top
X41  56.99,26.35 0 top
X42  56.99,33.02 0 top
X43  56.99,39.69 0 top
X44  56.99,46.35 0 top
X45  56.99,53.02 0 top
X46  56.99,59.69 0 top
X47  56.99,66.36 0 top
X48  56.99,73.03 0 top
X49  64.29,26.35 0 top
X50  64.29,33.02 0 top
X51  64.29,39.69 0 top
X52  64.29,46.35 0 top
X53  64.29,53.02 0 top
X54  64.29,59.69 0 top
X55  64.29,66.36 0 top
X56  64.29,73.03 0 top
X57  71.6,26.35 0 top
X58  71.6,33.02 0 top
X59  71.6,39.69 0 top
X60  71.6,46.35 0 top
X61  71.6,53.02 0 top
X62  71.6,59.69 0 top
X63  71.6,66.36 0 top
X64  71.6,73.03 0 top

### Tracks (layer width: path | path; a pad name or v marks a point on that pad's centre or on a via)
A0  (via drill 0.35)
  Top 0.152: U2.21 10.95,8.68 v10.95,6.03 | v25.56,6.19 A0L.2 A0H.1 27.57,5.24 32.67,5.24 CON.3
  Bottom 0.152: v10.95,6.03 11.27,6.03 11.75,5.56 24.92,5.56 v25.56,6.19
A1  (via drill 0.35)
  Top 0.152: U2.2 12.29,18.51 v12.22,18.57 | A1L.2 v25.56,10.32 A1H.1
  Bottom 0.152: v12.22,18.57 20.48,10.32 v25.56,10.32 30.83,10.32 CON.2
A2  (via drill 0.35)
  Top 0.152: U2.3 11.6,15.77 v11.6,17.46 | A2H.1 25.56,8.26 | v25.56,8.69 25.56,8.26 | 25.56,8.26 A2L.2
  Bottom 0.152: v11.6,17.46 11.6,15.08 17.99,8.69 v25.56,8.69 26.12,8.13 CON.1
BULB_VCC  (via drill 0.35)
  Top 0.61: Q1.2 12.22,25.4 | 12.22,25.4 11.53,25.4 R2.2 | Q2.2 12.38,32.07 | 12.38,32.07 11.53,32.07 R4.2 | Q3.2 12.38,38.74 | 12.38,38.74 11.53,38.74 R8.2 | Q4.2 12.38,45.41 | 12.38,45.41 11.53,45.41 R10.2 | Q5.2 12.38,52.07 | 12.38,52.07 11.53,52.07 R12.2 | Q6.2 12.22,58.74 | 12.22,58.74 11.53,58.74 R14.2 | Q7.2 12.38,65.41 | 12.38,65.41 11.53,65.41 R16.2 | 12.22,25.4 12.38,25.24 v12.38,24.45 | 12.38,32.07 v12.38,31.11 | 12.38,38.74 v12.38,37.78 | 12.38,45.41 v12.38,44.45 | 12.38,52.07 v12.38,51.12 | 12.22,58.74 12.38,58.58 v12.38,57.78 | 12.38,65.41 v12.38,64.45 | Q8.2 12.7,72.08 | 12.7,72.08 11.53,72.08 R18.2 | v12.38,71.12 12.38,71.76 12.7,72.08
  Bottom 0.61: v12.38,71.12 v12.38,64.45 v12.38,57.78 v12.38,51.12 v12.38,44.45 v12.38,37.78 v12.38,31.11 v12.38,24.45 25.2,11.63 48.7,11.63 50.8,9.53 CON.9
EXP_VCC
  Top 0.152: A1H.2 A2H.2 A0H.2 | A1H.2 28.31,10.95 27.04,12.22 20,12.22 17.86,10.08 17.45,9.67 15.24,7.46 15.08,7.46 | A1H.2 45.12,10.32 45.72,9.72 CON.7 | C1.1 15.08,7.46 | 15.08,7.46 13.82,8.72 U2.24
GND  (via drill 3.2)
  other vias: 2.54,78.74 78.74,78.74 78.74,2.54 2.54,2.54
  pour Top: -0.64,-3.17 -0.64,81.92 81.92,81.92 81.92,-3.17
  pour Bottom: -0.64,-3.17 -0.64,81.92 81.92,81.92 81.92,-3.17
N$1  (via drill 0.35)
  Top 0.61: Q10.3 23.03,22.38 v23.97,22.38
  Bottom 0.61: v23.97,22.38 21.75,24.61 X1.2 X2.2 X3.2 X4.2 X5.2 X6.2 X7.2 X8.2
N$3
  Top 0.61: D1.1 18.53,26.35 X1.1
N$4
  Top 0.305: T1.1 7.37,27.2 R1.2
N$5
  Top 0.305: Q1.1 11.53,27.3 R2.1 10.52,27.2 T1.3
N$6
  Top 0.305: Q11.1 27.71,20.01 R21.1
N$7
  Top 0.305: T2.1 7.37,33.87 R3.2
N$8
  Top 0.305: Q2.1 11.53,33.97 R4.1 10.52,33.87 T2.3
N$9
  Top 0.305: Q12.1 35.02,20.01 R23.1
N$10
  Top 0.61: D2.1 18.53,33.02 X2.1
N$11
  Top 0.61: D3.1 18.53,39.69 X3.1
N$12
  Top 0.305: Q13.1 42.32,20.01 R25.1
N$14
  Top 0.61: D4.1 18.53,46.35 X4.1
N$17
  Top 0.61: D5.1 18.53,53.02 X5.1
N$19
  Top 0.305: T4.1 7.37,40.54 R7.2
N$20
  Top 0.61: D6.1 18.53,59.69 X6.1
N$22
  Top 0.305: Q3.1 11.53,40.64 R8.1 10.52,40.54 T4.3
N$23
  Top 0.61: D7.1 18.53,66.36 X7.1
N$24
  Top 0.305: Q10.1 20.41,20.01 R19.1
N$25
  Top 0.305: T5.1 7.37,47.2 R9.2
N$26
  Top 0.61: D8.1 18.53,73.03 X8.1
N$28
  Top 0.305: Q4.1 11.53,47.3 R10.1 10.52,47.2 T5.3
N$29
  Top 0.305: T6.1 7.37,53.87 R11.2
N$30
  Top 0.305: Q5.1 11.53,53.97 R12.1 10.52,53.87 T6.3
N$31
  Top 0.305: T7.1 7.37,60.54 R13.2
N$32
  Top 0.305: Q6.1 11.53,60.64 R14.1 10.52,60.54 T7.3
N$33
  Top 0.305: T8.1 7.37,67.21 R15.2
N$34
  Top 0.305: Q7.1 11.53,67.31 R16.1 10.52,67.21 T8.3
N$35
  Top 0.305: T9.1 7.37,73.88 R17.2
N$36
  Top 0.305: Q8.1 11.53,73.97 R18.1 10.52,73.88 T9.3
N$45
  Top 0.61: D24.1 33.13,26.35 X17.1
N$46  (via drill 0.35)
  Top 0.61: Q12.3 37.63,22.38 v38.58,22.38
  Bottom 0.61: v38.58,22.38 36.35,24.61 X17.2 X18.2 X19.2 X20.2 X21.2 X22.2 X23.2 X24.2
N$48
  Top 0.61: D25.1 33.13,33.02 X18.1
N$50
  Top 0.61: D26.1 33.13,39.69 X19.1
N$51
  Top 0.61: D27.1 33.13,46.35 X20.1
N$52
  Top 0.61: D17.1 25.83,26.35 X9.1
N$53  (via drill 0.35)
  Top 0.61: Q11.3 30.33,22.38 v31.27,22.38
  Bottom 0.61: v31.27,22.38 29.05,24.61 X9.2 X10.2 X11.2 X12.2 X13.2 X14.2 X15.2 X16.2
N$55
  Top 0.61: D9.1 25.83,33.02 X10.1
N$56
  Top 0.61: D32.1 40.44,26.35 X25.1
N$57
  Top 0.61: D10.1 25.83,39.69 X11.1
N$58
  Top 0.61: D11.1 25.83,46.35 X12.1
N$59
  Top 0.61: D12.1 25.83,53.02 X13.1
N$60
  Top 0.61: D13.1 25.83,59.69 X14.1
N$61
  Top 0.61: D14.1 25.83,66.36 X15.1
N$62
  Top 0.61: D15.1 25.83,73.03 X16.1
N$63  (via drill 0.35)
  Top 0.61: Q13.3 44.94,22.38 v45.88,22.38
  Bottom 0.61: v45.88,22.38 43.66,24.61 X25.2 X26.2 X27.2 X28.2 X29.2 X30.2 X31.2 X32.2
N$65
  Top 0.61: D33.1 40.44,33.02 X26.1
N$67
  Top 0.61: D34.1 40.44,39.69 X27.1
N$68
  Top 0.61: D35.1 40.44,46.35 X28.1
N$69
  Top 0.61: D28.1 33.13,53.02 X21.1
N$70
  Top 0.61: D29.1 33.13,59.69 X22.1
N$71
  Top 0.61: D30.1 33.13,66.36 X23.1
N$72
  Top 0.61: D31.1 33.13,73.03 X24.1
N$79
  Top 0.61: D36.1 40.44,53.02 X29.1
N$80
  Top 0.61: D37.1 40.44,59.69 X30.1
N$81
  Top 0.61: D38.1 40.44,66.36 X31.1
N$82
  Top 0.61: D39.1 40.44,73.03 X32.1
N$113
  Top 0.61: D63.1 47.74,26.35 X33.1
N$114  (via drill 0.35)
  Top 0.61: Q17.3 52.24,22.38 v53.18,22.38
  Bottom 0.61: v53.18,22.38 50.96,24.61 X33.2 50.96,32.23 50.8,32.38 50.8,32.86 X34.2 X35.2 X36.2 X37.2 X38.2 X39.2 50.96,72.39 51.12,72.55 51.12,72.87 X40.2
N$115
  Top 0.61: D64.1 47.74,33.02 X34.1
N$116
  Top 0.61: D65.1 47.74,39.69 X35.1
N$117
  Top 0.61: D66.1 47.74,46.35 X36.1
N$118
  Top 0.61: D67.1 47.74,53.02 X37.1
N$119
  Top 0.61: D68.1 47.74,59.69 X38.1
N$120
  Top 0.61: D69.1 47.74,66.36 X39.1
N$121
  Top 0.61: D70.1 47.74,73.03 X40.1
N$122
  Top 0.305: Q17.1 49.62,20.01 R33.1
N$123
  Top 0.61: D71.1 55.04,26.35 X41.1
N$124  (via drill 0.35)
  Top 0.61: Q18.3 59.54,22.38 v60.48,22.38
  Bottom 0.61: v60.48,22.38 58.26,24.61 X41.2 X42.2 X43.2 X44.2 X45.2 X46.2 X47.2 X48.2
N$125
  Top 0.61: D72.1 55.04,33.02 X42.1
N$126
  Top 0.61: D73.1 55.04,39.69 X43.1
N$127
  Top 0.61: D74.1 55.04,46.35 X44.1
N$128
  Top 0.61: D75.1 55.04,53.02 X45.1
N$129
  Top 0.61: D22.1 55.04,59.69 X46.1
N$130
  Top 0.61: D76.1 55.04,66.36 X47.1
N$131
  Top 0.61: D77.1 55.04,73.03 X48.1
N$132
  Top 0.305: Q18.1 56.92,20.01 R35.1
N$133
  Top 0.61: D78.1 62.34,26.35 X49.1
N$134  (via drill 0.35)
  Top 0.61: Q19.3 66.84,22.38 v67.79,22.38
  Bottom 0.61: v67.79,22.38 65.56,24.61 X49.2 X50.2 X51.2 X52.2 X53.2 X54.2 X55.2 X56.2
N$135
  Top 0.61: D79.1 62.34,33.02 X50.1
N$136
  Top 0.61: D80.1 62.34,39.69 X51.1
N$137
  Top 0.61: D81.1 62.34,46.35 X52.1
N$138
  Top 0.61: D82.1 62.34,53.02 X53.1
N$139
  Top 0.61: D83.1 62.34,59.69 X54.1
N$140
  Top 0.61: D84.1 62.34,66.36 X55.1
N$141
  Top 0.61: D85.1 62.34,73.03 X56.1
N$142
  Top 0.305: Q19.1 64.23,20.01 R37.1
N$143
  Top 0.61: D86.1 69.64,26.35 X57.1
N$144
  Top 0.61: Q20.3 72.87,23.32 X57.2
  Bottom 0.61: X64.2 X63.2 X62.2 X61.2 X60.2 X59.2 X58.2 X57.2
N$145
  Top 0.61: Q1.3 D1.2 16.83,24.45 17.46,23.81 23.29,23.81 D17.2 24.97,23.81 30.59,23.81 D24.2 32.27,23.81 37.9,23.81 D32.2 39.58,23.81 45.2,23.81 D63.2 46.04,24.45 46.67,23.81 52.5,23.81 D71.2 54.18,23.81 59.8,23.81 D78.2 61.48,23.81 67.11,23.81 D86.2
N$146
  Top 0.61: D87.1 69.64,33.02 X58.1
N$147
  Top 0.61: Q2.3 D2.2 | D2.2 | D87.2 67.11,30.48 61.48,30.48 D79.2 59.8,30.48 54.18,30.48 D72.2 52.5,30.48 46.88,30.48 D64.2 45.2,30.48 39.58,30.48 D33.2 37.9,30.48 32.27,30.48 D25.2 30.59,30.48 24.97,30.48 D9.2 23.29,30.48 17.67,30.48 D2.2
N$148
  Top 0.61: D88.1 69.64,39.69 X59.1
N$149
  Top 0.61: D89.1 69.64,46.35 X60.1
N$150
  Top 0.61: D90.1 69.64,53.02 X61.1
N$151
  Top 0.61: D91.1 69.64,59.69 X62.1
N$152
  Top 0.61: D92.1 69.64,66.36 X63.1
N$153
  Top 0.61: D93.1 69.64,73.03 X64.1
N$154
  Top 0.61: Q3.3 D3.2 | D3.2 | D88.2 67.11,37.15 61.48,37.15 D80.2 59.8,37.15 54.18,37.15 D73.2 52.5,37.15 46.88,37.15 D65.2 45.2,37.15 39.58,37.15 D34.2 37.9,37.15 32.27,37.15 D26.2 30.59,37.15 24.97,37.15 D10.2 23.29,37.15 17.67,37.15 D3.2
N$155
  Top 0.61: Q4.3 D4.2 | D4.2 | D89.2 67.11,43.81 61.48,43.81 D81.2 59.8,43.81 54.18,43.81 D74.2 52.5,43.81 46.88,43.81 D66.2 45.2,43.81 39.58,43.81 D35.2 37.9,43.81 32.27,43.81 D27.2 30.59,43.81 24.97,43.81 D11.2 23.29,43.81 17.67,43.81 D4.2
N$156
  Top 0.61: Q5.3 D5.2 | D5.2 | D90.2 67.11,50.48 61.48,50.48 D82.2 59.8,50.48 54.18,50.48 D75.2 52.5,50.48 46.88,50.48 D67.2 45.2,50.48 39.58,50.48 D36.2 37.9,50.48 32.27,50.48 D28.2 30.59,50.48 24.97,50.48 D12.2 23.29,50.48 17.67,50.48 D5.2
N$157
  Top 0.61: Q6.3 D6.2 | D6.2 | D91.2 67.11,57.15 61.48,57.15 D83.2 59.8,57.15 54.18,57.15 D22.2 52.5,57.15 46.88,57.15 D68.2 45.2,57.15 39.58,57.15 D37.2 37.9,57.15 32.27,57.15 D29.2 30.59,57.15 24.97,57.15 D13.2 23.29,57.15 17.67,57.15 D6.2
N$158
  Top 0.61: Q7.3 D7.2 | D7.2 | D92.2 67.11,63.82 61.48,63.82 D84.2 59.8,63.82 54.18,63.82 D76.2 52.5,63.82 46.88,63.82 D69.2 45.2,63.82 39.58,63.82 D38.2 37.9,63.82 32.27,63.82 D30.2 30.59,63.82 24.97,63.82 D14.2 23.29,63.82 17.67,63.82 D7.2
N$159
  Top 0.61: Q8.3 D8.2 17.67,70.48 23.29,70.48 D15.2 24.97,70.48 30.59,70.48 D31.2 32.27,70.48 37.9,70.48 D39.2 39.58,70.48 45.2,70.48 D70.2 46.88,70.48 52.5,70.48 D77.2 54.18,70.48 59.8,70.48 D85.2 61.48,70.48 67.11,70.48 D93.2
N$160
  Top 0.305: Q20.1 71.53,20.01 R39.1
P00  (via drill 0.35)
  Top 0.152: R1.1 5.71,24.61 6.51,23.81 v11.21,23.81 | v10.8,18.26 10.99,18.07 U2.4
  Bottom 0.152: v11.21,23.81 11.21,18.67 v10.8,18.26
P01  (via drill 0.35)
  Top 0.152: R3.1 5.71,31.27 6.19,30.8 v10.45,30.8 | v10.3,17.46 10.3,15.77 U2.5
  Bottom 0.152: v10.45,30.8 10.19,30.54 10.19,18 10.3,17.9 v10.3,17.46
P02  (via drill 0.35)
  Top 0.152: R7.1 5.71,38.1 6.35,37.47 v9.84,37.47 | v9.59,18.16 9.69,18.06 U2.6
  Bottom 0.152: v9.59,18.16 9.53,18.22 9.53,37.15 v9.84,37.47
P03  (via drill 0.35)
  Top 0.152: R9.1 5.71,44.77 6.35,44.13 v9.1,44.13 | v9,17.46 9,15.77 U2.7
  Bottom 0.152: v9.1,44.13 8.78,43.81 8.78,18.93 8.95,18.75 8.95,17.51 v9,17.46
P04  (via drill 0.35)
  Top 0.152: R11.1 5.71,51.44 6.51,50.64 v8.17,50.64 | U2.8 8.39,17.2 8.39,18.13 v8.34,18.18
  Bottom 0.152: v8.17,50.64 8.01,50.48 8.01,18.67 8.34,18.34 v8.34,18.18
P05  (via drill 0.35)
  Top 0.152: R13.1 7.32,57.23 v7.41,57.23 | v7.79,17.45 7.79,15.77 U2.9
  Bottom 0.152: v7.41,57.23 7.25,57.07 7.25,18.87 7.74,18.38 7.74,17.51 v7.79,17.45
P06  (via drill 0.35)
  Top 0.152: R15.1 5.71,64.93 6.35,64.29 v6.64,64.29 | v7.07,18.18 7.07,15.75 U2.10
  Bottom 0.152: v6.64,64.29 6.48,64.14 6.48,18.78 v7.07,18.18
P07  (via drill 0.35)
  Top 0.152: R17.1 v5.71,71.12 | v6.35,17.46 6.44,17.37 U2.11
  Bottom 0.152: v5.71,71.12 5.71,18.1 v6.35,17.46
P10
  Top 0.152: R20.1 17.36,21.8 16.51,20.95 16.51,16.07 14.51,14.07 8.84,14.07 5.79,11.03 U2.13
  Top 0.305: R20.1 R19.2
P11  (via drill 0.35)
  Top 0.152: v25.08,18.57 19.92,18.57 15.11,13.77 9.08,13.77 6.44,11.13 U2.14 | v28.81,21.83 28.79,21.8 R21.2
  Top 0.305: R22.1 R21.2
  Bottom 0.152: v25.08,18.57 28.34,21.83 v28.81,21.83
P12  (via drill 0.35)
  Top 0.152: v33.02,17.62 19.87,17.62 15.72,13.46 9.26,13.46 7.09,11.29 U2.15 | v36.12,21.83 36.09,21.8 R23.2
  Top 0.305: R23.2 R24.1
  Bottom 0.152: v36.12,21.83 36.12,20.72 v33.02,17.62
P13  (via drill 0.35)
  Top 0.152: v34.29,16.67 19.83,16.67 16,12.84 9.61,12.84 7.74,10.98 U2.16 | v43.42,21.83 43.4,21.8 R25.2
  Top 0.305: R25.2 R26.1
  Bottom 0.152: v43.42,21.83 38.26,16.67 v34.29,16.67
P14  (via drill 0.35)
  Top 0.152: v47.78,15.72 19.78,15.72 16.29,12.22 9.95,12.22 8.39,10.66 U2.17 | v50.64,21.83 50.62,21.8 R33.2
  Top 0.305: R33.2 R34.1
  Bottom 0.152: v47.78,15.72 47.89,15.72 50.64,18.47 v50.64,21.83
P15  (via drill 0.35)
  Top 0.152: v48.74,14.76 19.74,14.76 16.57,11.6 10.3,11.6 9.04,10.34 U2.18 | v58.02,21.83 58,21.8 R35.2
  Top 0.305: R36.1 R35.2
  Bottom 0.152: v58.02,21.83 50.96,14.76 v48.74,14.76
P16  (via drill 0.35)
  Top 0.152: v49.69,13.81 19.69,13.81 16.86,10.97 10.64,10.97 9.69,10.02 U2.19 | v65.33,21.83 65.3,21.8 R37.2
  Top 0.305: R37.2 R38.1
  Bottom 0.152: v65.33,21.83 57.31,13.81 v49.69,13.81
P17  (via drill 0.35)
  Top 0.152: v50.64,12.89 19.68,12.89 17.14,10.35 10.99,10.35 10.34,9.71 U2.20 | v72.55,21.83 72.53,21.8 R39.2
  Top 0.305: R39.2 R40.1
  Bottom 0.152: v72.55,21.83 63.61,12.89 v50.64,12.89
SCL  (via drill 0.35)
  Top 0.152: U2.22 11.64,7.2 v11.59,7.14
  Bottom 0.152: CON.5 40.64,6.54 39.32,5.22 28.01,5.22 26.4,6.83 13.65,6.83 13.02,6.19 12.22,6.19 11.59,6.83 v11.59,7.14
SDA  (via drill 0.35)
  Top 0.152: U2.23 12.29,7.46 v12.63,7.12
  Bottom 0.152: v12.63,7.12 12.63,7.15 12.94,7.45 26.68,7.45 28.29,5.84 36.92,5.84 38.1,7.02 CON.4

### Text on the board
Top: 8x8 Bulb Matrix / by Ripper121 / / ripper121.com
tStop: 8x8 Bulb Matrix / by Ripper121 / / ripper121.com